# Altium schematic sheet Volt_Metter_SCH.SchDoc
size A; SheetNumber: 1; SheetTotal: 1
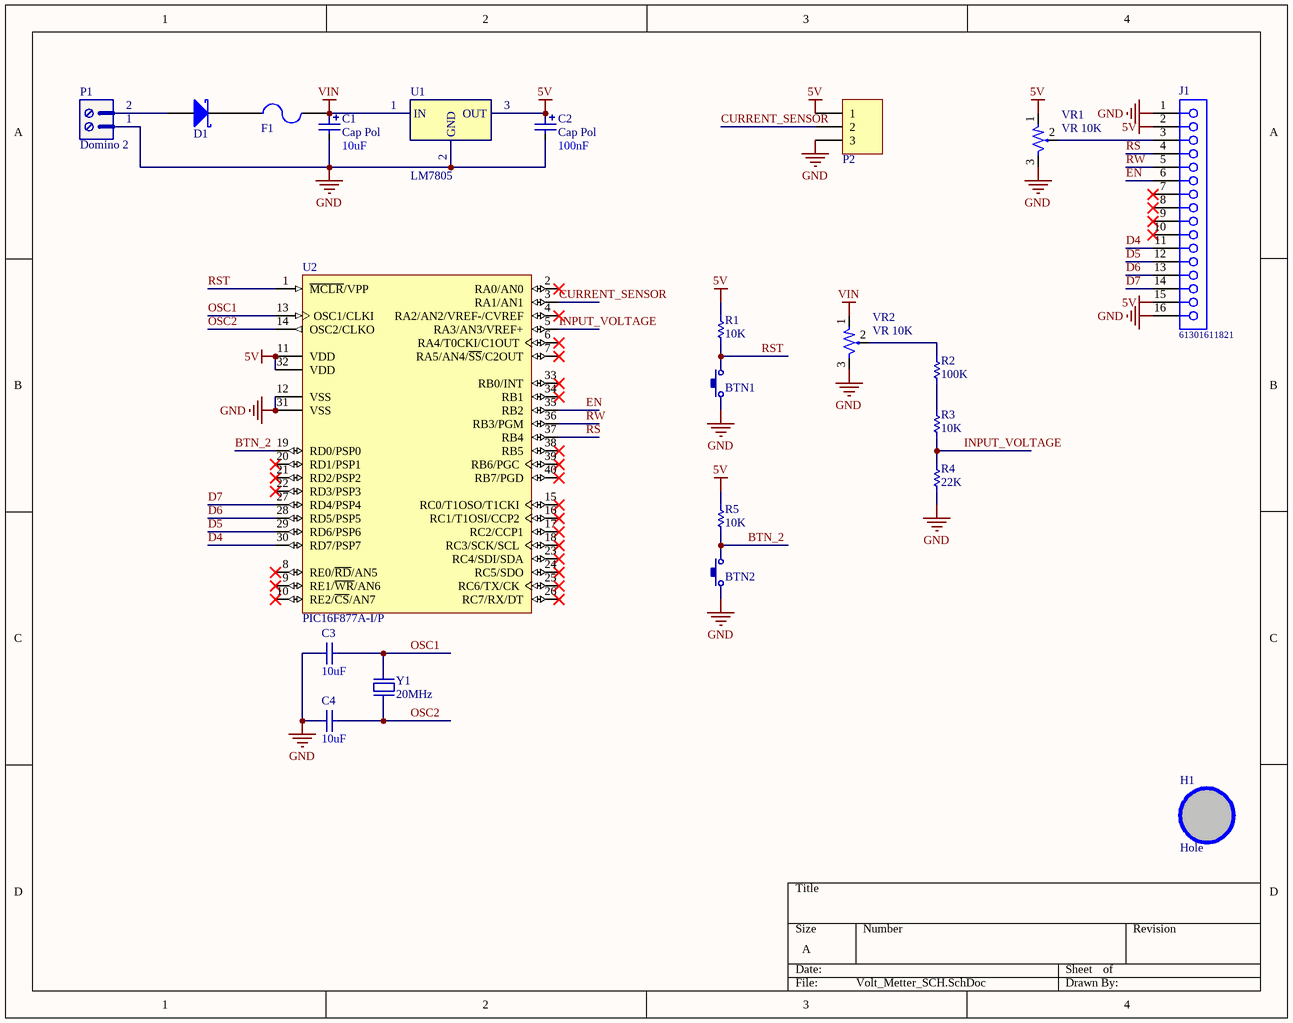
[diagram p0: Volt_Metter_SCH.SchDoc]

## Parts
BTN1  Button  [Button]  (value not drawn)
BTN2  Button  [Button]  (value not drawn)
C1  Cap Pol  value 10uF  [CP1/2.5]
C2  Cap Pol  value 100nF  [CP1/2.5]
C3  value 10uF  [CAP-SM-0805]  (hidden comment: Cap Non-Pol SMD)
C4  value 10uF  [CAP-SM-0805]  (hidden comment: Cap Non-Pol SMD)
D1  D Schottky  [SS34]  (value not drawn)
F1  Fuse  [FUSE SMD]  (value not drawn)
H1  Hole  [LO KHOAN 3MM]
J1  61301611821  [61301611821]
P1  Domino 2  [DOMINO 2- 5mm]
P2  Header 3  [JP3]  (value not drawn)
R1  value 10K  [RES-SM-0805]  (hidden comment: Resistor 1/4W)
R2  value 100K  [RES-SM-0805]  (hidden comment: Resistor 1/4W)
R3  value 10K  [RES-SM-0805]  (hidden comment: Resistor 1/4W)
R4  value 22K  [RES-SM-0805]  (hidden comment: Resistor 1/4W)
R5  value 10K  [RES-SM-0805]  (hidden comment: Resistor 1/4W)
U1  LM7805  [QTO-220]
U2  PIC16F877A-I/P  [PDIP600-P40]
VR1  value VR 10K  [Varistor 1]  (hidden comment: 10K)
VR2  value VR 10K  [Varistor 1]  (hidden comment: 10K)
Y1  20MHz  [XT2]

## Nets
5V: C2.1 J1.2 J1.15 P2.1 R1.2 R5.2 U1.3(OUT) U2.11(VDD) U2.32(VDD) VR1.1
GND: BTN1.1 BTN2.1 C1.2 C2.2 C3.1 C4.1 J1.1 J1.16 P1.1 P2.3 R4.1 U1.2(GND) U2.12(VSS) U2.31(VSS) VR1.3 VR2.3
VIN: C1.1 F1.2 U1.1(IN) VR2.1
BTN_2: BTN2.2 R5.1 U2.19(RD0/PSP0)
CURRENT_SENSOR: P2.2 U2.3(RA1/AN1)
D4: J1.11 U2.30(RD7/PSP7)
D5: J1.12 U2.29(RD6/PSP6)
D6: J1.13 U2.28(RD5/PSP5)
D7: J1.14 U2.27(RD4/PSP4)
EN: J1.6 U2.35(RB2)
INPUT_VOLTAGE: R3.1 R4.2 U2.5(RA3/AN3/VREF+)
OSC1: C3.2 U2.13(OSC1/CLKI) Y1.2
OSC2: C4.2 U2.14(OSC2/CLKO) Y1.1
RS: J1.4 U2.37(RB4)
RST: BTN1.2 R1.1 U2.1(~{MCLR}/VPP)
RW: J1.5 U2.36(RB3/PGM)
NetD1_1: D1.1(A) P1.2
NetD1_2: D1.2(K) F1.1
NetJ1_3: J1.3 VR1.2
NetR2_1: R2.1 R3.2
NetR2_2: R2.2 VR2.2

Not connected (* = marked no-connect by the designer): H1 1; J1 7* 8* 9* 10*; U2 2(RA0/AN0)* 4(RA2/AN2/VREF-/CVREF)* 6(RA4/T0CKI/C1OUT)* 7(RA5/AN4/~{SS}/C2OUT)* 8(RE0/~{RD}/AN5)* 9(RE1/~{WR}/AN6)* 10(RE2/~{CS}/AN7)* 15(RC0/T1OSO/T1CKI)* 16(RC1/T1OSI/CCP2)* 17(RC2/CCP1)* 18(RC3/SCK/SCL)* 20(RD1/PSP1)* 21(RD2/PSP2)* 22(RD3/PSP3)* 23(RC4/SDI/SDA)* 24(RC5/SDO)* 25(RC6/TX/CK)* 26(RC7/RX/DT)* 33(RB0/INT)* 34(RB1)* 38(RB5)* 39(RB6/PGC)* 40(RB7/PGD)*

## Library data of the parts
C1 C2 = Cap Pol: Polarized Capacitor (Radial)
C3 C4 = Cap Non-Pol SMD: Capacitor
D1 = D Schottky: Schottky Diode; Published: 8-Jun-2000; LatestRevisionDate: 17-Jul-2002; LatestRevisionNote: Re-released for DXP Platform.; PackageReference: SMB; Publisher: Altium Limited; PackageDescription: DO-214-AA/SMB; 2 C-Bend Leads; Body 5.3 x 3.6 mm, inc. leads (LxW); Code_JEDEC: DO-214-AA
H1 = Hole: Hole 3mm
J1 = 61301611821: WR-PHD Socket Header, THT, pitch 2.54mm, Single Row, Vertical, 16p; Manufacturer: Wurth Elektronik; Pin Number: 16; Rated Current: 3A; Working Voltage: 250VAC; Withstanding Voltage: 500VAC; Contact Resistance: 20mOhm; ComponentLink1Description: Manufacturer; ComponentLink1URL: http://www.we-online.de; ComponentLink2Description: Datasheet; ComponentLink2URL: https://www.we-online.com/catalog/datasheet/61301611821.pdf; Manufacturer Part Number: 61301611821; Published Date: May 2020; Pitch: 2.54mm; Operating Temperature: -40 to +125degC; Mounting Technology: THT; Packaging: Tray; Gender: Socket Header; Row Number: Single; Orientation: Vertical
P1 = Domino 2: Domino, 2-Pin; LatestRevisionDate: 17-Jul-2002; LatestRevisionNote: Re-released for DXP Platform.; Publisher: Altium Limited
P2 = Header 3: Header, 3-Pin; LatestRevisionDate: 17-Jul-2002; LatestRevisionNote: Re-released for DXP Platform.; Publisher: Altium Limited
R1-R5 = RES
U1 = LM7805: Positive Voltage Regulator
U2 = PIC16F877A-I/P: Enhanced FLASH Microcontroller, 8K (x14-Bit words) FLASH, 368 Bytes RAM, 40-Pin PDIP, Standard VDD Range, Industrial Temperature; ComponentAvailability: Unknown. Contact manufacturer to determine status.; PackageVersion: revBB, Aug-2009; PackageReference: PDIP600-P40; PackageDescription: 40-Lead Plastic Dual In-Line (P) - 600 mil Body [PDIP]; DatasheetVersion: revB, Oct-2003; PartNumber: PIC16F877A-I/P
VR1 VR2 = Var Resistor
Y1 = XTAL: Crystal For all Crystal 2pin